# Altium schematic sheet ICS307_Clock_Generator.SchDoc
size A
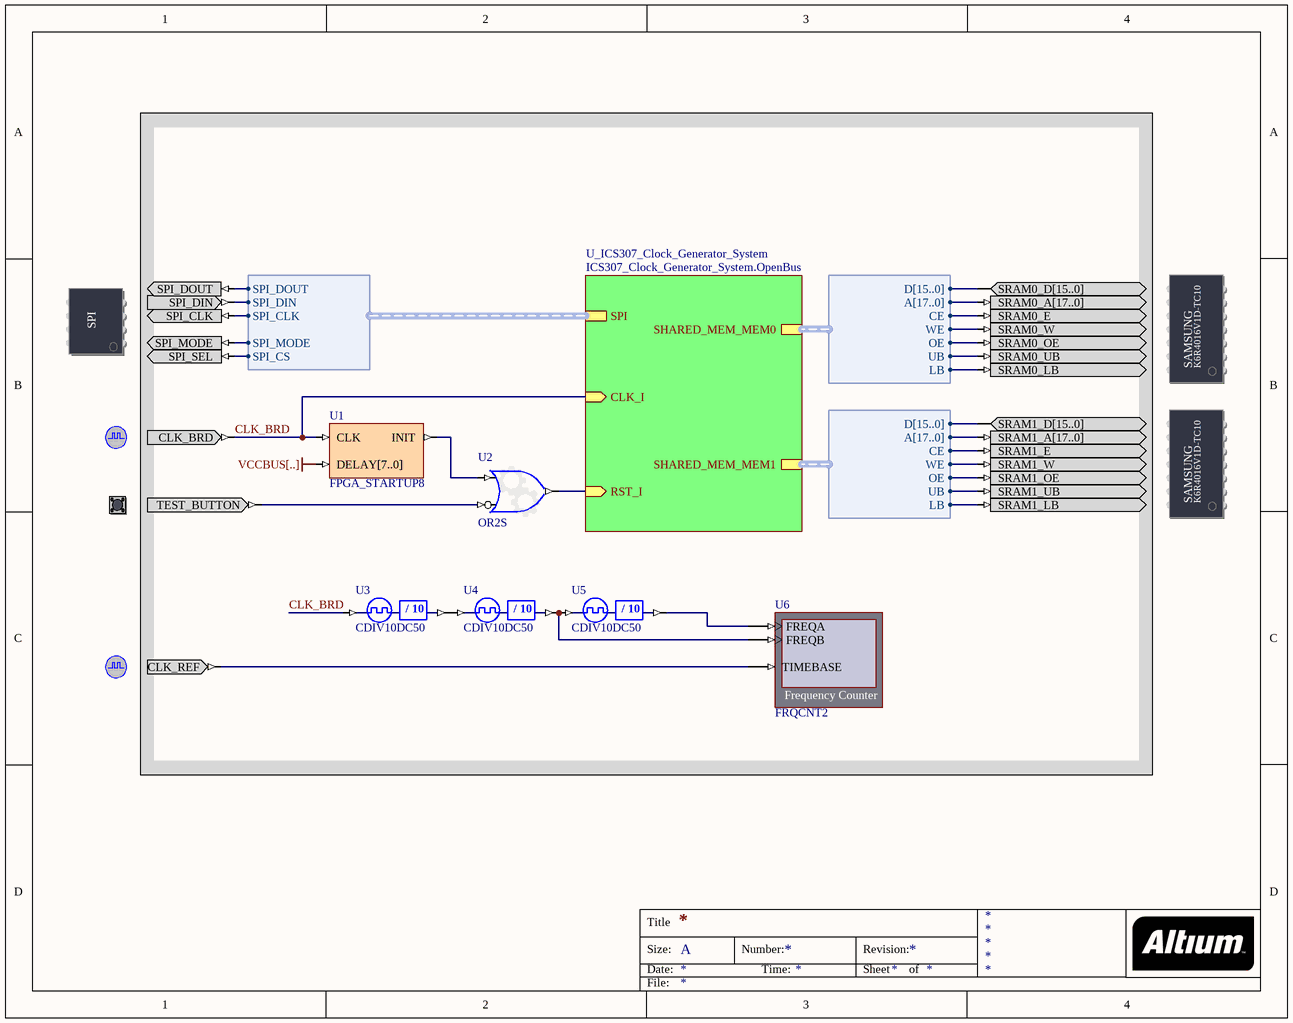
[diagram p0: ICS307_Clock_Generator.SchDoc]

## Parts
(Parts that share a designator on the sheet are numbered #1, #2 ... from top to bottom, then left to right.)
?#1  SPI_BUS  (value not drawn)
?#2  SRAM_DAUGHTER0  (value not drawn)
?#3  SRAM_DAUGHTER1  (value not drawn)
?#4  CLOCK_BOARD  (value not drawn)
?#5  TEST_BUTTON  (value not drawn)
?#6  CLOCK_REFERENCE  (value not drawn)
U1  FPGA_STARTUP8
U2  OR2S
U3  CDIV10DC50
U4  CDIV10DC50
U5  CDIV10DC50
U6  FRQCNT2

## Sub-sheets
U_ICS307_Clock_Generator_System = ICS307_Clock_Generator_System.OpenBus: SHARED_MEM_MEM0 (harness WB_MEM_CTRL_SRAM16_A18), SHARED_MEM_MEM1 (harness WB_MEM_CTRL_SRAM16_A18), SPI (harness SPI_W_NB), RST_I (in), CLK_I (in)

## Harnesses
WB_MEM_CTRL_SRAM16_A18: D[15..0], A[17..0], CE, WE, OE, UB, LB
SPI_W_NB: SPI_DOUT, SPI_DIN, SPI_CLK, SPI_MODE, SPI_CS

## Nets
VCCBUS[..]: U1.DELAY[7..0]
CLK_BRD: ?#4.CLK_BRD U1.CLK U3.CLKIN ; sheet U_ICS307_Clock_Generator_System/CLK_I
Net?#1_SPI_CLK: ?#1.SPI_CLK ; sheet U_ICS307_Clock_Generator_System/SPI.SPI_CLK
Net?#1_SPI_DIN: ?#1.SPI_DIN ; sheet U_ICS307_Clock_Generator_System/SPI.SPI_DIN
Net?#1_SPI_DOUT: ?#1.SPI_DOUT ; sheet U_ICS307_Clock_Generator_System/SPI.SPI_DOUT
Net?#1_SPI_MODE: ?#1.SPI_MODE ; sheet U_ICS307_Clock_Generator_System/SPI.SPI_MODE
Net?#1_SPI_SEL: ?#1.SPI_SEL ; sheet U_ICS307_Clock_Generator_System/SPI.SPI_CS
Net?#2_SRAM0_A[17..0]: ?#2.SRAM0_A[17..0] ; sheet U_ICS307_Clock_Generator_System/SHARED_MEM_MEM0.A[17..0]
Net?#2_SRAM0_D[15..0]: ?#2.SRAM0_D[15..0] ; sheet U_ICS307_Clock_Generator_System/SHARED_MEM_MEM0.D[15..0]
Net?#2_SRAM0_E: ?#2.SRAM0_E ; sheet U_ICS307_Clock_Generator_System/SHARED_MEM_MEM0.CE
Net?#2_SRAM0_LB: ?#2.SRAM0_LB ; sheet U_ICS307_Clock_Generator_System/SHARED_MEM_MEM0.LB
Net?#2_SRAM0_OE: ?#2.SRAM0_OE ; sheet U_ICS307_Clock_Generator_System/SHARED_MEM_MEM0.OE
Net?#2_SRAM0_UB: ?#2.SRAM0_UB ; sheet U_ICS307_Clock_Generator_System/SHARED_MEM_MEM0.UB
Net?#2_SRAM0_W: ?#2.SRAM0_W ; sheet U_ICS307_Clock_Generator_System/SHARED_MEM_MEM0.WE
Net?#3_SRAM1_A[17..0]: ?#3.SRAM1_A[17..0] ; sheet U_ICS307_Clock_Generator_System/SHARED_MEM_MEM1.A[17..0]
Net?#3_SRAM1_D[15..0]: ?#3.SRAM1_D[15..0] ; sheet U_ICS307_Clock_Generator_System/SHARED_MEM_MEM1.D[15..0]
Net?#3_SRAM1_E: ?#3.SRAM1_E ; sheet U_ICS307_Clock_Generator_System/SHARED_MEM_MEM1.CE
Net?#3_SRAM1_LB: ?#3.SRAM1_LB ; sheet U_ICS307_Clock_Generator_System/SHARED_MEM_MEM1.LB
Net?#3_SRAM1_OE: ?#3.SRAM1_OE ; sheet U_ICS307_Clock_Generator_System/SHARED_MEM_MEM1.OE
Net?#3_SRAM1_UB: ?#3.SRAM1_UB ; sheet U_ICS307_Clock_Generator_System/SHARED_MEM_MEM1.UB
Net?#3_SRAM1_W: ?#3.SRAM1_W ; sheet U_ICS307_Clock_Generator_System/SHARED_MEM_MEM1.WE
Net?#5_TEST_BUTTON: ?#5.TEST_BUTTON U2.I1
Net?#6_CLK_REF: ?#6.CLK_REF U6.TIMEBASE
NetU1_INIT: U1.INIT U2.I0
NetU2_O: U2.O ; sheet U_ICS307_Clock_Generator_System/RST_I
NetU3_CLKDV: U3.CLKDV U4.CLKIN
NetU4_CLKDV: U4.CLKDV U5.CLKIN U6.FREQB
NetU5_CLKDV: U5.CLKDV U6.FREQA

## Notes on the sheet
- Title
- Size:
- Date:
- A
- Number:
- Time:
- Revision:
- Sheet
- of
- File:
- (in symbol CDIV10DC50) / 10
- (in symbol SPI_BUS) SPI
- (in symbol SRAM_DAUGHTER0) SAMSUNG; K6R4016V1D-TC10
- (in symbol SRAM_DAUGHTER1) SAMSUNG; K6R4016V1D-TC10

## Library data of the parts
?#1 = SPI_BUS: Generic SPI Bus; PortComponent: True; Published: 22-Jan-2007; Publisher: Altium Limited; HelpURL: TR0143 Technical Reference Manual for Altium's Desktop NanoBoard NB2DSK01.pdf#page=55
?#2 = SRAM_DAUGHTER0: Free Static RAM - Daughterboard; PortComponent: True; Published: 14-May-2007; Publisher: Altium Limited; HelpURL: TR0149 Technical Reference for Altium's Xilinx Spartan-3 Daughter Board DB30.pdf#page=16
?#3 = SRAM_DAUGHTER1: Free Static RAM - Daughterboard; PortComponent: True; Published: 14-May-2007; Publisher: Altium Limited; HelpURL: TR0149 Technical Reference for Altium's Xilinx Spartan-3 Daughter Board DB30.pdf#page=16
?#4 = CLOCK_BOARD: Global System Clock Supply; PortComponent: True; Published: 19-Nov-2003; Publisher: Altium Limited; HelpURL: TR0143 Technical Reference Manual for Altium's Desktop NanoBoard NB2DSK01.pdf#page=41; UseInDSF: True
?#5 = TEST_BUTTON: Test / Reset Button; PortComponent: True; Published: 19-Nov-2003; Publisher: Altium Limited; HelpURL: TR0143 Technical Reference Manual for Altium's Desktop NanoBoard NB2DSK01.pdf#page=53
?#6 = CLOCK_REFERENCE: Global System Clock Reference Supply; PortComponent: True; Published: 19-Nov-2003; Publisher: Altium Limited; HelpURL: TR0102 NanoBoard Technical Reference Manual - NB1.pdf#page=29
U1 = FPGA_STARTUP8: FPGA Startup With 8 Bit Delay; Published: 9-Dec-2004; Publisher: Altium Limited; HelpURL: CR0119 FPGA_STARTUPx Powerup Delay Unit.pdf; LastRevisionNo: 1.00.00; ComponentLink1Description: Core &Resource Usage; ComponentLink1URL: CR0139 FPGA Peripheral Resource Usage.pdf#page=11
U2 = GATE: Configurable Generic Gate; ConfiguratorName: GENERIC_GATE; ConfigurationParameters: {}Version[1.0]{}GateKind[OR]{}BusInput[False]{}GateInputType[Bit]{}GateOutputOption[Normal]{}BusWidth[8]{}RegisterOutputs[False]{}NegativeClockEdge[False]{}InputCount[2]{}InputInvert0[False]{}InputInvert1[True]{}; LastRevisionNo: 1.00.00; Published: 3-Sep-2008; Publisher: Altium Limited
U3-U5 = CDIV10DC50: Clock Divider by 10 with 50% Duty Cycle Output; XilinxEquivalent: CLK_DIV10; DivisorRate: 10; DutyCycle: 50; ArchiveName: GENERIC; VHDLIB_SIM: GENERIC_LIB; Published: 29-Jan-2004; Publisher: Altium Limited; LastRevisionNo: 1.00.00; HelpURL: CR0118 FPGA Generic Library Guide.pdf#page=143; ComponentLink1URL: CR0127 FPGA Clock Divider Resource Usage.pdf#page=15; ComponentLink1Description: Core &Resource Usage; FunctionalClass: Clock Divider
U6 = FRQCNT2: Frequency Counter; NEXUS_CORE: Instrument; NEXUS_JTAG_DEVICE: True; NEXUS_JTAG_ORDER: 0; Published: 3-Nov-2004; Publisher: Altium Limited; Core Revision: 1.00.00; ComponentLink1Description: Core &Resource Usage; ComponentLink1URL: CR0134 FPGA Instrument Resource Usage.pdf#page=3; HelpURL: CR0101 FRQCNT2 Frequency Counter.pdf; LastRevisionNo: 1.00.00